# EAGLE design Adafruit Si1145 Breakout (EAGLE 6.6.0)
COMPANY: ADAFRUIT INDUSTRIES; DRAWN: KTOWN; REV: A
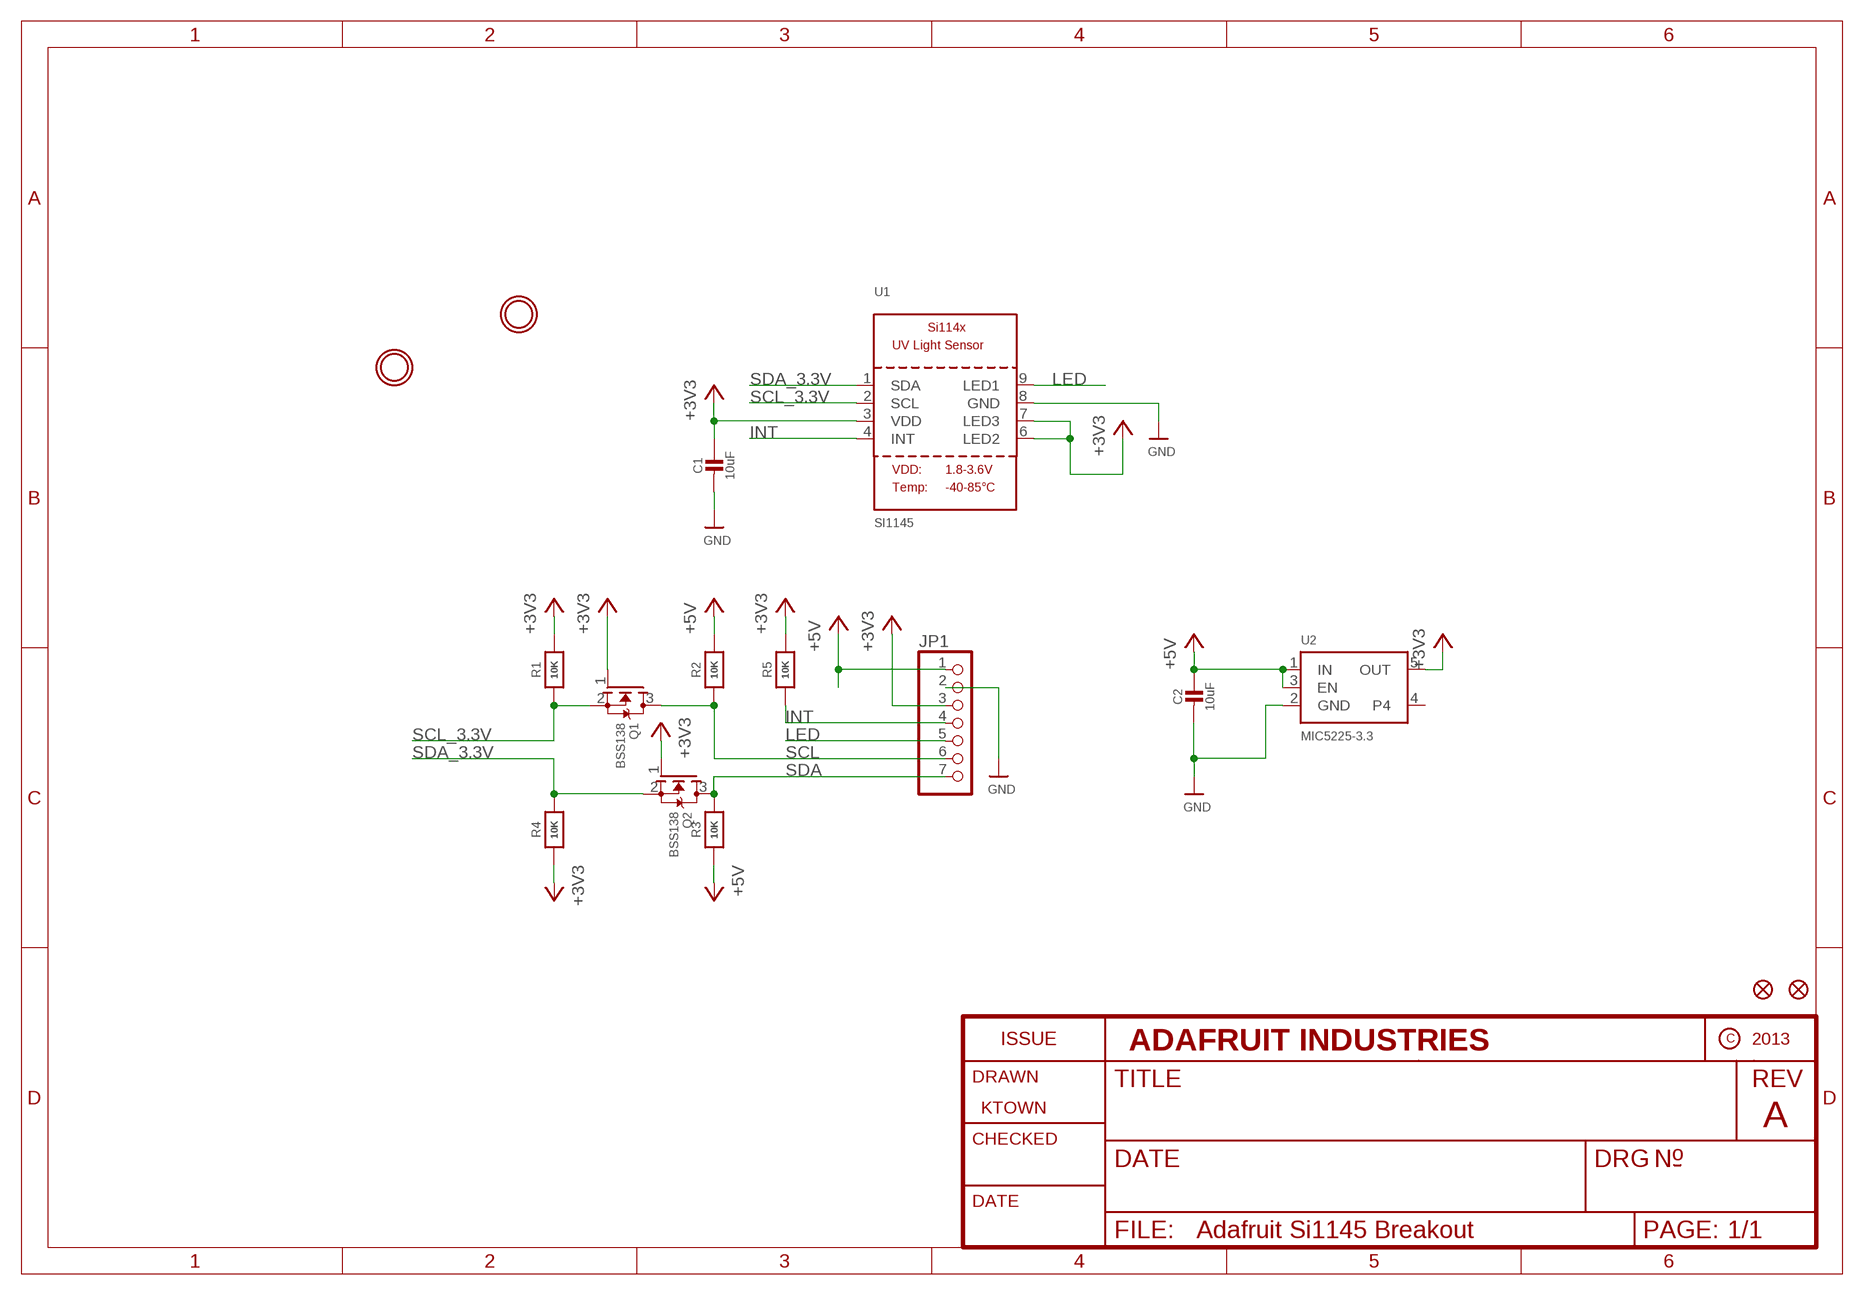
[diagram p0: schematic, sheet 1]

## Parts
C1  10uF  CAP_CERAMIC0805-NOOUTLINE  [0805-NO]
C2  10uF  CAP_CERAMIC0805-NOOUTLINE  [0805-NO]
FID1  FIDUCIAL""  [FIDUCIAL_1MM]
FID2  FIDUCIAL""  [FIDUCIAL_1MM]
JP1  HEADER-1X770MIL  [1X07_ROUND_70]
Q1  BSS138  MOSFET-NWIDE  [SOT23-WIDE]
Q2  BSS138  MOSFET-NWIDE  [SOT23-WIDE]
R1  10K  RESISTOR0805_NOOUTLINE  [0805-NO]
R2  10K  RESISTOR0805_NOOUTLINE  [0805-NO]
R3  10K  RESISTOR0805_NOOUTLINE  [0805-NO]
R4  10K  RESISTOR0805_NOOUTLINE  [0805-NO]
R5  10K  RESISTOR0805_NOOUTLINE  [0805-NO]
U1  SI1145  SI114X  [SI114X]
U2  MIC5225-3.3  VREG_SOT23-5  [SOT23-5]
U$5  MOUNTINGHOLE2.5  [MOUNTINGHOLE_2.5_PLATED]
U$6  MOUNTINGHOLE2.5  [MOUNTINGHOLE_2.5_PLATED]

## Nets
+3V3: C1.1 JP1.3 Q1.1(G) Q2.1(G) R1.2 R4.1 R5.2 U1.3(VDD) U1.6(LED2) U1.7(LED3) U2.5(OUT)
GND: C1.2 C2.2 JP1.2 U1.8(GND) U2.2(GND)
INT: JP1.4 R5.1 U1.4(INT)
LED: JP1.5 U1.9(LED1)
SCL: JP1.6 Q1.3(D) R2.1
SCL_3.3V: Q1.2(S) R1.1 U1.2(SCL)
SDA: JP1.7 Q2.3(D) R3.2
SDA_3.3V: Q2.2(S) R4.2 U1.1(SDA)
VIN: C2.1 JP1.1 R2.2 R3.1 U2.1(IN) U2.3(EN) ; supply symbol labelled +5V
Unconnected: U2.4

## Library data of the parts
C1 C2 = microbuilder:CAP_CERAMIC: Ceramic Capacitors For new designs, use the packages preceded by an '_' character since they are more reliable: The following footprints should be used on most boards: _0402 - Standard footprint for regular board layouts _0603 - Standard footprint for regular board layouts _0805 - Standard footprint for regular board layouts _1206 - Standard footprint for regular board layouts For extremely tight-pitch boards where space is at a premium, the following 'micro-pitch' footprints can be used (smaller pads, no silkscreen outline, etc.): _0402MP - Micro-pitch footprint for very dense/compact boards _0603MP - Micro-pitch footprint for very dense/compact boards _0805MP - Micro-pitch footprint for very dense/compact boards _1206MP - Micro-pitch footprint for very dense/compact boards
FID1 FID2 = microbuilder:FIDUCIAL: Fiducial Alignment Points Various fiducial points for machine vision alignment.; BOM: EXCLUDE
JP1 = microbuilder:HEADER-1X7: PIN HEADER
Q1 Q2 = microbuilder:MOSFET-N: N-Channel Mosfet LEGEND VDS: Voltage Drain-Source ID: Drain Current RDS(ON): Drain-Source On-State Resistance VGS(TH): Gate-Source Threshold Voltage CISS: Drain-Source Input Capacitance SOT-23 Name VDS ID RDS(ON) VGS(TH) CISS Order Number 2N7002E 60V 260mA 2.5 Ohm 2.5V @ 250uA 26.7pF @ 25V 2N7002ET1GOSTR-ND BSH103 30V 850mA 400 mOhm 400mV @ 1mA 83pF @ 24V BSH103,235-ND BSS138 60V 320mA 1.6 Ohm 1.5V @ 250uA 50pF @ 10V Mouser: 771-BSS138PW115 DMN2075U-7 20V 4.2A 38 mOhm 1V @ 250 uA 594.3pF @ 10V DMN2075U-7DICT-ND * BSS138 good choice for I2C level-shifting POWERPAK 1212-8 Name VDS ID RDS(ON) VGS(TH) CISS Order Number Si7308DN 60V 6A 58 mOhm 3V @ 250uA 665pF @ 15V SI7308DN-T1-E3CT-ND
R1-R5 = microbuilder:RESISTOR: Resistors For new designs, use the packages preceded by an '_' character since they are more reliable: The following footprints should be used on most boards: _0402 - Standard footprint for regular board layouts _0603 - Standard footprint for regular board layouts _0805 - Standard footprint for regular board layouts _1206 - Standard footprint for regular board layouts For extremely tight-pitch boards where space is at a premium, the following 'micro-pitch' footprints can be used (smaller pads, no silkscreen outline, etc.): _0402MP - Micro-pitch footprint for very dense/compact boards _0603MP - Micro-pitch footprint for very dense/compact boards _0805MP - Micro-pitch footprint for very dense/compact boards _1206MP - Micro-pitch footprint for very dense/compact boards
U1 = microbuilder:SI114X: Si1145/1146/1147 Proximity/UV/Ambient Light Sensor 1145 = 1 LED, 1146 = 2 LED, 1147 = 3 LED Proximity: 1-50cm LEDs: 5.6-360mA each
U2 = microbuilder:VREG_SOT23-5: SOT23-5 Fixed Voltage Regulators Part Current Out V Out V In V Dropout θJA (°C/W) TJ (°C) Digikey Part No. ADP121 150mA 3.3V 3.4-5.5V 0.09V @ 150mA -- -- ADP121-AUJZ33R7CT-ND ADP121 150mA 3.0V 3.1-5.5V 0.09V @ 150mA -- -- ADP121-AUJZ30R7CT-ND ADP122 300mA 3.3V 3.4-5.5V 0.085V @ 300mA -- -- ADP122AUJZ-3.3-R7CT-ND ADP1712 300mA 3.3V 3.5-5.5V 0.17V @ 300mA -- -- ADP1712AUJZ-3.3-R7TR-ND AP7311 (Low Cost) 150mA 3.3V 3.5-6V 0.15V @ 150mA -- -- AP7311-33WG-7DICT-ND LD39015M18R 150mA 1.8V 1.9V-5.5V 0.08V @ 100mA -- -- 497-6977-1-ND LP2985A-33DBVR 150mA 3.3V 3.3-16V 0.28V @ 150mA 206 150 296-18479-1-ND MCP1824T-3302E/OT 300mA 3.3V 3.5V-6V 0.2V @ 300mA -- -- MCP1824T-3302E/OTCT-ND MIC5205-2.5YM5 TR 150mA 2.5V 2.7-16V 0.165V @ 150mA -- -- 576-1257-2-ND MIC5205-3.0YM5 TR 150mA 3.0V 3.2V-16V 0.165V @ 150mA -- -- 576-1258-2-ND MIC5205-3.3YM5 TR 150mA 3.3V 3.5V-16V 0.165V @ 150mA -- -- 576-1259-2-ND TPS780330220 150mA 3.3V+2.2V 3.6-5.5V 250mV Max -- -- 296-23332-1-ND TDA3663/N1,135 100mA 3.3V 3.5-45V 0.18V @ 50mA -- -- 568-5343-1-ND Max operating temp can be calculated using θJA, TJ (max junction temperature), and power in watts. Set the "Maximum Ambient Temperature" until it reaches TJ ("Max Junction Temperature"), which is the absolute limit for safe use of the regulator: Heat Sink Temperature Calculator <http://www.daycounter.com/Calculators/Heat-Sink-Temperature-Calculator.phtml> For example, With 12V source into a 3.3V LP2985 and a 30mA load, we are dissipating (12V-3.3V) * 0.03A = 0.261W. With a θJA of 206 °C/W, a TJ of 150°C, and 261mW we can safely use the chip without a heat sink up to 75°C (=147.1°C Junction Temperature).
U$5 U$6 = microbuilder:MOUNTINGHOLE: Mounting Hole For #2 screws (0.086"/2.18mm width, 0.094"/2.4mm hole) use 2.5mm; BOM: EXCLUDE

## Board
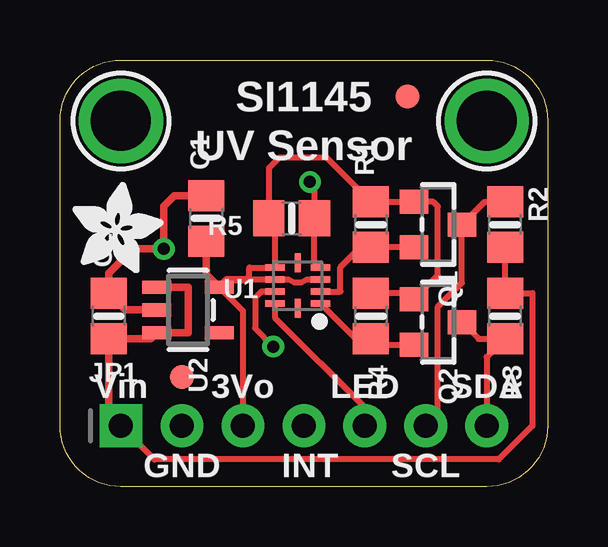
[diagram p1: board, top side]
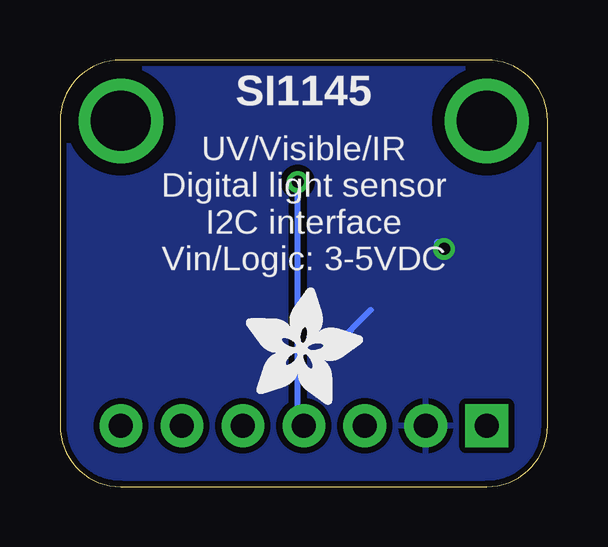
[diagram p2: board, bottom side, seen from below]

Size 20.32 x 17.78 mm. Coordinates in mm from the lower left corner, seen from the top.
Outline: 0,2.54 0,15.24 arc-90 2.54,17.78 17.78,17.78 arc-90 20.32,15.24 20.32,2.54 arc-90 17.78,0 2.54,0 arc-90 0,2.54
Copper layers (1*16): Top 0.035mm / dielectric 1.5mm / Bottom 0.035mm
Design rules "adafruit": minimum track width 8mil, minimum drill 15.5mil, track to track 8mil, track to pad 8mil, pad to pad 8mil, via to via 8mil, smd to smd 8mil, copper to edge 10mil, drill to drill 8mil, minimum pad ring 10mil, minimum via ring 8mil, stop-mask expansion 2mil, vias tented up to drill 20mil, thermal gap 10mil

### Footprints (pad centres in the part's own frame; a part is rotated, then mirrored left to right if it is on the bottom)
0805-NO = smd 1.3 x 1.5: 1 -0.95,0; 2 0.95,0
FIDUCIAL_1MM = smd 1 x 1: 1 0,0
1X07_ROUND_70 = drill 1 pad 1.778 square: 1 -7.62,0 | drill 1 pad 1.778: 2 -5.08,0; 3 -2.54,0; 4 0,0; 5 2.54,0; 6 5.08,0; 7 7.62,0
SOT23-WIDE = smd 1 x 1.2: 1 -0.95,-1; 2 0.95,-1; 3 0,1
SI114X = smd 0.8 x 0.26: 1 -0.95,0.75; 2 -0.95,0.25; 3 -0.95,-0.25; 4 -0.95,-0.75; 6 0.95,-0.75; 7 0.95,-0.25; 8 0.95,0.25; 9 0.95,0.75 | smd 0.26 x 0.8: 5 0,-0.95; 10 0,0.95
SOT23-5 = smd 0.55 x 1.2: 1 -0.95,-1.3; 2 0,-1.3; 3 0.95,-1.3; 4 0.95,1.3; 5 -0.95,1.3
MOUNTINGHOLE_2.5_PLATED = drill 2.5 pad 3.2: P$1 0,0

### Placement (x,y rotation side)
C1  6.1,11.18 90 top
C2  2.03,7.11 90 top
FID1  14.48,16.26 0 top
FID2  5.08,4.57 0 top
JP1  10.16,2.54 0 top
Q1  15.75,10.92 270 top
Q2  15.75,6.86 270 top
R1  12.95,10.92 90 top
R2  18.54,10.92 270 top
R3  18.54,7.11 270 top
R4  12.95,7.11 270 top
R5  9.65,11.18 180 top
U1  9.91,8.38 180 top
U2  5.33,7.37 270 top
U$3  [ADAFRUIT_3.5MM]  0.51,8.89 0 top
U$5  2.54,15.24 0 top
U$6  17.78,15.24 0 top
U$8  [ADAFRUIT_5MM]  12.57,3.43 0 bottom

### Tracks (layer width: path | path; a pad name or v marks a point on that pad's centre or on a via)
+3V3
  Top 0.254: R4.1 14.24,8.06 Q2.1 15.75,8.81 15.75,11.68 15.56,11.87 Q1.1 R1.2 11.11,13.72 9.14,13.72 8.7,13.27 R5.2 8.96,11.43 U1.6 7.89,9.13 7.89,8.63 U1.7 9.53,8.63 9.78,8.51 10.03,8.51 10.28,8.63 U1.3 | U2.5 7.62,7.33 JP1.3
  Top 0.305: C1.1 6.1,8.85 U2.5 6.95,8.63 7.89,8.63
GND  (via drill 0.5)
  Top 0.254: U1.8 8.39,8.13 8.13,7.87 8.13,6.6 v8.89,5.84
  Top 0.305: U2.2 2.73,7.37 C2.2 2.03,8.89 3.05,9.91 v4.32,9.91 4.32,11.68 4.76,12.13 C1.2
  Bottom 0.254: v8.89,5.84 7.37,7.37
  Bottom 0.305: v4.32,9.91 4.57,10.16
  pour Bottom (isolate 0.254): 0,17.78 20.07,17.78 20.07,0 0,0
INT  (via drill 0.5)
  Top 0.254: U1.4 10.6,9.39 R5.1 10.6,12.51 v10.41,12.7
  Bottom 0.254: JP1.4 10.41,2.79 v10.41,12.7
LED
  Top 0.254: U1.9 8.96,7.05 12.7,3.3 JP1.5
SCL
  Top 0.254: R2.1 17.7,11.87 Q1.3 16.75,8.49 15.75,7.49 15.75,3.05 JP1.6
SCL_3.3V
  Top 0.254: Q1.2 R1.1 12.51,9.97 11.68,9.14 11.68,8.13 U1.2
SDA
  Top 0.254: Q2.3 17.44,6.16 R3.2 17.78,5.4 JP1.7
SDA_3.3V
  Top 0.254: U1.1 12.33,6.16 R4.2 12.95,5.91 Q2.2
VIN
  Top 0.254: R2.2 R3.1 19.68,8.06 19.68,2.54 18.29,1.14 3.94,1.14 JP1.1
  Top 0.305: JP1.1 2.03,3.05 C2.1 3.78,6.16 U2.3 5.33,6.42 5.33,8.32 U2.1

### Text on the board
tPlace: SI1145 | UV Sensor | Vin | 3Vo | LED | SDA | GND | INT | SCL
bPlace: SI1145 | UV/Visible/IR / Digital light sensor / I2C interface / Vin/Logic: 3-5VDC